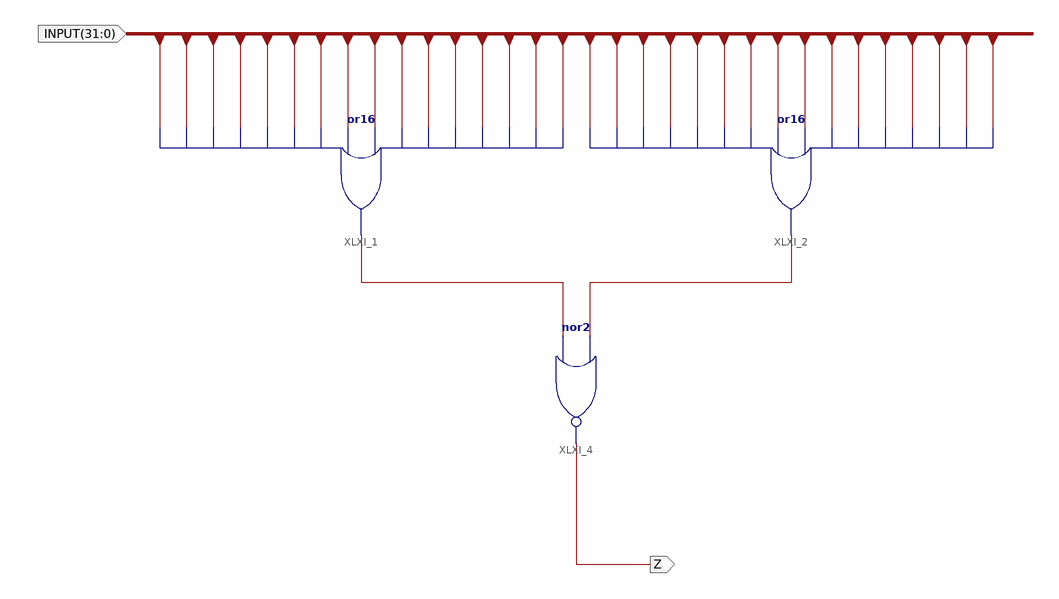
[diagram p0: schematic sheet 1]
// Xilinx ISE schematic set_zerobit.sch (spartan3e) as structural Verilog: 3 symbols, 2 ports
module set_zerobit (
  input  [31:0] INPUT,
  output Z
);

  wire XLXN_3, XLXN_4;

  or XLXI_1 (XLXN_3, INPUT[31], INPUT[30], INPUT[29], INPUT[28], INPUT[27], INPUT[26], INPUT[25], INPUT[24], INPUT[23], INPUT[22], INPUT[21], INPUT[20], INPUT[19], INPUT[18], INPUT[17], INPUT[16]);
  or XLXI_2 (XLXN_4, INPUT[15], INPUT[14], INPUT[13], INPUT[12], INPUT[11], INPUT[10], INPUT[9], INPUT[8], INPUT[7], INPUT[6], INPUT[5], INPUT[4], INPUT[3], INPUT[2], INPUT[1], INPUT[0]);
  nor XLXI_4 (Z, XLXN_3, XLXN_4);
endmodule
